# Altium project QSTL_MicroDSUB_Socket_FFC.PrjPcb
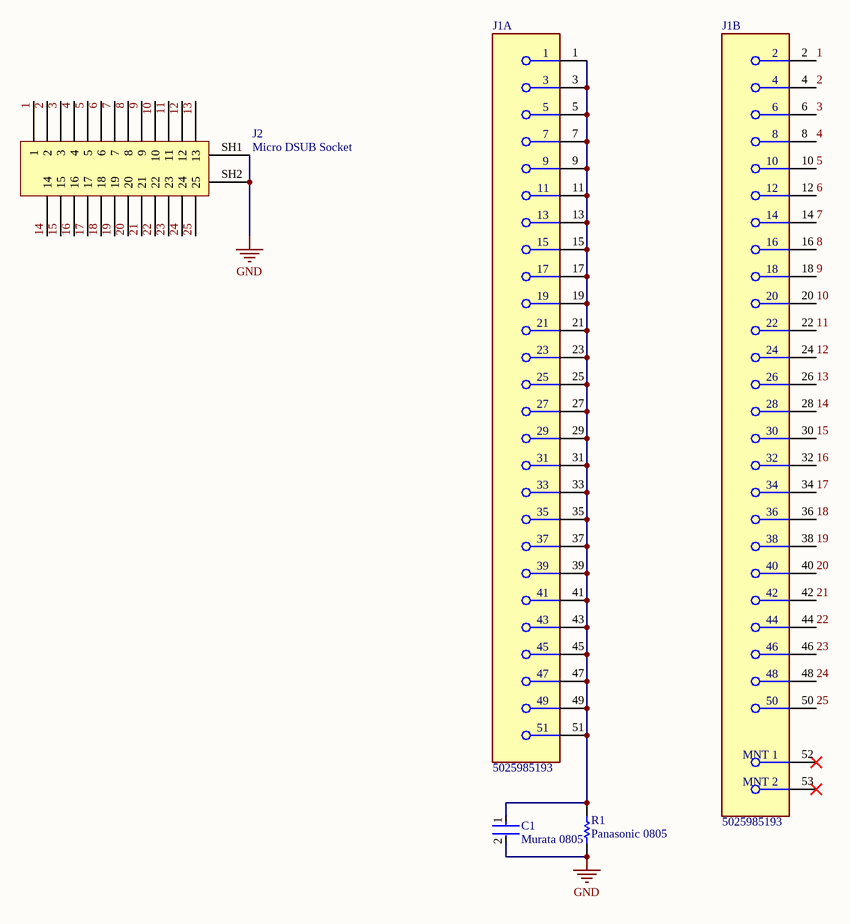
[diagram p0: QSTL_MicroDSUB_Socket_FFC.SchDoc]
1 sheet, 4 parts. Net scope: global (net labels, ports and power ports of the same name join across sheets).
Board file: QSTL_MicroDSUB_Socket_FFC.PcbDoc

## Sheet QSTL_MicroDSUB_Socket_FFC.SchDoc
size A4; SheetNumber: 1; SheetTotal: 1

### Parts
C1  Murata 0805  [FP-GRM21B-0_15-MFG]
J1  5025985193  [FP-5025985193-MFG]  (parts A,B of 2)
J2  Micro DSUB Socket  [380-025-213L001]
R1  Panasonic 0805  [RESC2013X60X40LL20T25]

### Nets
GND: C1.2 J2.SH1 J2.SH2 R1.2
1: J1.2 J2.1
2: J1.4 J2.2
3: J1.6 J2.3
4: J1.8 J2.4
5: J1.10 J2.5
6: J1.12 J2.6
7: J1.14 J2.7
8: J1.16 J2.8
9: J1.18 J2.9
10: J1.20 J2.10
11: J1.22 J2.11
12: J1.24 J2.12
13: J1.26 J2.13
14: J1.28 J2.14
15: J1.30 J2.15
16: J1.32 J2.16
17: J1.34 J2.17
18: J1.36 J2.18
19: J1.38 J2.19
20: J1.40 J2.20
21: J1.42 J2.21
22: J1.44 J2.22
23: J1.46 J2.23
24: J1.48 J2.24
25: J1.50 J2.25
NetC1_1: C1.1 J1.1 J1.3 J1.5 J1.7 J1.9 J1.11 J1.13 J1.15 J1.17 J1.19 J1.21 J1.23 J1.25 J1.27 J1.29 J1.31 J1.33 J1.35 J1.37 J1.39 J1.41 J1.43 J1.45 J1.47 J1.49 J1.51 R1.1

Not connected (* = marked no-connect by the designer): J1 52(MNT_1)* 53(MNT_2)*

### Library data of the parts
C1 = CMP-2000-07555-2: Chip Multilayer Ceramic Capacitors for General Purpose, 0805, 10uF, X7R, 15%, 10%, 10V; Length: 2mm; Case Code (Metric): 2012; Height: 1.25mm; Tolerance: 10%; Width: 1.25mm; Voltage Rating: 10V; Voltage Rating (DC): 10V; Case/Package: 0805; Package Quantity: 3000; Capacitance: 10uF; REACH SVHC: No SVHC; Case Code (Imperial): 0805; Min Operating Temperature: -55°C; Termination: SMD/SMT; Depth: 1.25mm; Mount: Surface Mount; Thickness: 0.055inch; Max Operating Temperature: 125°C; Weight: 0.000335oz; Dielectric: X7R; Packaging: Tape and Reel
J1 = CMP-1241-00093-2: CONN FPC 51POS 0.30MM R/A; Manufacturer: Molex; Is Female: yes; Voltage Rating: 50V; Current Rating: 0.3A; Pitch: 0.6mm; Number Of Contacts: 51; Import Ts: 1521860080; Conn Orientation: Right Angle; Ciiva Ids: 8412513; Conn Gender: Female; Device Class L2: FFC / FPC; ComponentLink2Description: Datasheet; Contact Material: Gold,Nickel; Automotive: No; Temperature Range High: +105°C; Ambient Temperature Range Low: -40°C; Height: 1.83mm; Temperature Range Low: -40°C; Package: 0; Mouser Description: FFC & FPC Connectors 0.3 FPC BackFlip Hsg RA SMT 51Ckt; Device Class L3: unset; Digikey Description: CONN FPC 51POS 0.30MM R/A; RoHS: TRUE; Temperature: -40°C to +105°C; Octopart: https://octopart.com/502598-5193-molex-33127991; ComponentLink2URL: https://www.molex.com/webdocs/datasheets/pdf/en-us/5025985193_FFC_FPC_CONNECTORS.pdf; Manufacturer Part Number: 5025985193; Release Date: 1411372322; Ambient Temperature Range High: +105°C; Category: Conn; Device Class L1: Connectors; Footprint Url: https://www.molex.com/pdm_docs/sd/5025985193_sd.pdf; Lead Free: Yes
J2 = 380-025-213L001: https://www.digikey.ca/en/products/detail/norcomp-inc/380-025-213L001/2798600?s=N4IgTCBcDaIMwA4AMBaJYCsKwEY4BkkkcQBdAXyA
R1 = CMP-2001-00613-1: Part Number: ERA6AEB222V; Manufacturer: Panasonic